# EAGLE schematic experiment single buffer (EAGLE 9.6.2)
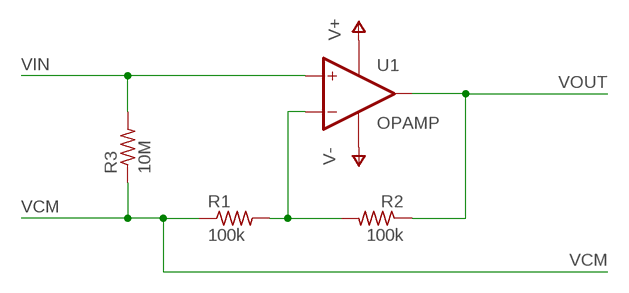
[diagram p0: schematic, sheet 1]

## Parts
R1  100k  R-US_R0805  [R0805]
R2  100k  R-US_R0805  [R0805]
R3  10M  R-US_R0805  [R0805]
U1  OPAMP  (no package)

## Nets
N$3: R1.2 R2.2 U1.-IN
V+: U1.V+
V-: U1.V-
VCM: R1.1 R3.1
VIN: R3.2 U1.+IN
VOUT: R2.1 U1.OUT

## Library data of the parts
R1-R3 = rcl:R-US_: RESISTOR, American symbol; SPICEPREFIX: R
U1 = Generic:OPAMP: Generic OpAmp device with supply rails connected